# Altium project xucxacdientu.PrjPcb
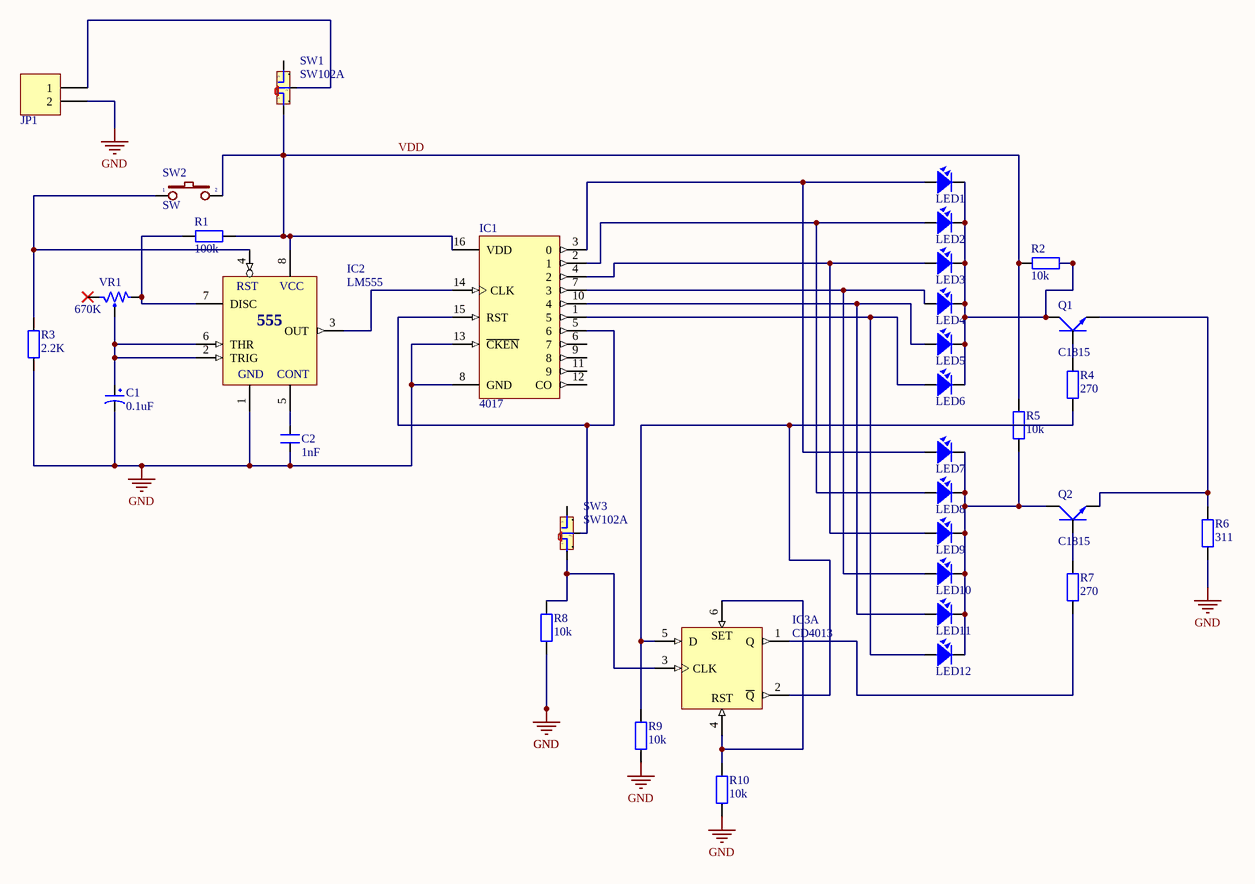
[diagram p0: Sheet1.SchDoc]
1 sheet, 34 parts. Net scope: global (net labels, ports and power ports of the same name join across sheets).
Board files: PCB1.PcbDoc, PCB2.PcbDoc

## Sheet Sheet1.SchDoc
size A3; SheetNumber: 1; SheetTotal: 1

### Parts
C1  0.1uF  [CP1/2]
C2  1nF  [CN1.5]
IC1  4017  [Dip16/w0.3]
IC2  LM555  [DIP8/W0.3]
IC3  CD4013  [DIP14/W0.3]  (part A of 2)
JP1  Header 2_1  [HED2]  (value not drawn)
LED1  LED  [LED-5-RED]  (value not drawn)
LED2  LED  [LED-5-RED]  (value not drawn)
LED3  LED  [LED-5-RED]  (value not drawn)
LED4  LED  [LED-5-RED]  (value not drawn)
LED5  LED  [LED-5-RED]  (value not drawn)
LED6  LED  [LED-5-RED]  (value not drawn)
LED7  LED  [LED-5-RED]  (value not drawn)
LED8  LED  [LED-5-RED]  (value not drawn)
LED9  LED  [LED-5-RED]  (value not drawn)
LED10  LED  [LED-5-RED]  (value not drawn)
LED11  LED  [LED-5-RED]  (value not drawn)
LED12  LED  [LED-5-RED]  (value not drawn)
Q1  C1815  [QTO-92]
Q2  C1815  [QTO-92]
R1  100k  [R1/4W]
R2  10k  [R1/4W]
R3  2.2K  [R1/4W]
R4  270  [R1/4W]
R5  10k  [R1/4W]
R6  311  [R1/4W]
R7  270  [R1/4W]
R8  10k  [R1/4W]
R9  10k  [R1/4W]
R10  10k  [R1/4W]
SW1  SW102A  [SW102]
SW2  SW  [SW2]
SW3  SW102A  [SW102]
VR1  670K  [VR]

### Nets
GND: C1.2 C2.1 IC1.8(GND) IC1.13(~{CKEN}) IC2.1(GND) IC3.7(GND) JP1.2 R3.1 R6.2 R8.2 R9.1 R10.1
VDD: IC1.16(VDD) IC2.8(VCC) IC3.14(VDD) R1.1 R2.2 R5.2 SW1.1 SW2.2
NetC1_1: C1.1 IC2.2(TRIG) IC2.6(THR) VR1.2
NetC2_2: C2.2 IC2.5(CONT)
NetIC1_1: IC1.1(5) LED6.1 LED12.1
NetIC1_2: IC1.2(1) LED2.1 LED8.1
NetIC1_3: IC1.3(0) LED1.1 LED7.1
NetIC1_4: IC1.4(2) LED3.1 LED9.1
NetIC1_5: IC1.5(6) IC1.15(RST) SW3.2
NetIC1_7: IC1.7(3) LED4.1 LED10.1
NetIC1_10: IC1.10(4) LED5.1 LED11.1
NetIC1_14: IC1.14(CLK) IC2.3(OUT)
NetIC2_4: IC2.4(RST) R3.2 SW2.1
NetIC2_7: IC2.7(DISC) R1.2 VR1.1
NetIC3_1: IC3.1(Q) R7.1
NetIC3_2: IC3.2(~{Q}) IC3.5(D) R4.2 R9.2
NetIC3_3: IC3.3(CLK) R8.1 SW3.1
NetIC3_4: IC3.4(RST) IC3.6(S) R10.2
NetJP1_1: JP1.1 SW1.2
NetLED1_2: LED1.2 LED2.2 LED3.2 LED4.2 LED5.2 LED6.2 Q1.2(C) R2.1
NetLED7_2: LED7.2 LED8.2 LED9.2 LED10.2 LED11.2 LED12.2 Q2.2(C) R5.1
NetQ1_1: Q1.1(E) Q2.1(E) R6.1
NetQ1_3: Q1.3(B) R4.1
NetQ2_3: Q2.3(B) R7.2

Not connected (* = marked no-connect by the designer): IC1 6(7) 9(8) 11(9) 12(CO); SW1 3 4 5; SW3 3 4 5; VR1 3*

### Notes on the sheet
- (in symbol CD4013B, part A) SET
- (in symbol LM555) 555

### Library data of the parts
C1 = CP1: Cap P  0,1uF < 22uF , 16 - 50V; Value: 10uF/50V; Description 1: 10 => 220uF/6,3V/10V - 10uF => 100uF/16V; Description 2: 0,1uF => 33uF/50V - 10uF => 22uF/63V; Description 3: 0,47uF => 10uF/100V
C2 = CN1.5: Cap np 682pF => 104pF; Value: 0.01uF
IC1 = 4017: Decade Counter/Divider with 10 Decoded Outputs; Designed by: VanDungEvn; Value: CD4017
IC2 = LM555: Timer; Value: LM555
IC3 = CD4013B: Dual D-Type Flip-Flop; Creat by: VanDungEvn@Gmail.com
JP1 = Header 2_1: Header, 2-Pin; Manufacturer: Generic Components; Class: Connector; Value: Header 2
LED1-LED12 = LED: LED Single colour Green and Red; Value: LED 3 ly Single Colour
Q1 Q2 = C1815: NPN 600mW, ECB; Value: C1815
R1-R10 = R1/4W: Resistor 1/4W; Value: R1/4W - 1K
SW1 SW3 = SW102A: Switch 102 on Broad; Value: Switch 102 On Board
SW2 = SW2: Switch button 2 pin; Value: SW chip 2 pin
VR1 = VR1: Var Resistor; Value: VR 10K